# EasyEDA schematic EasyEDA.json
TITLE: Talaria MX5 Killswitch; REV: 1.0; Date: 2026-06-07; Sheet: 1/1; Company: -
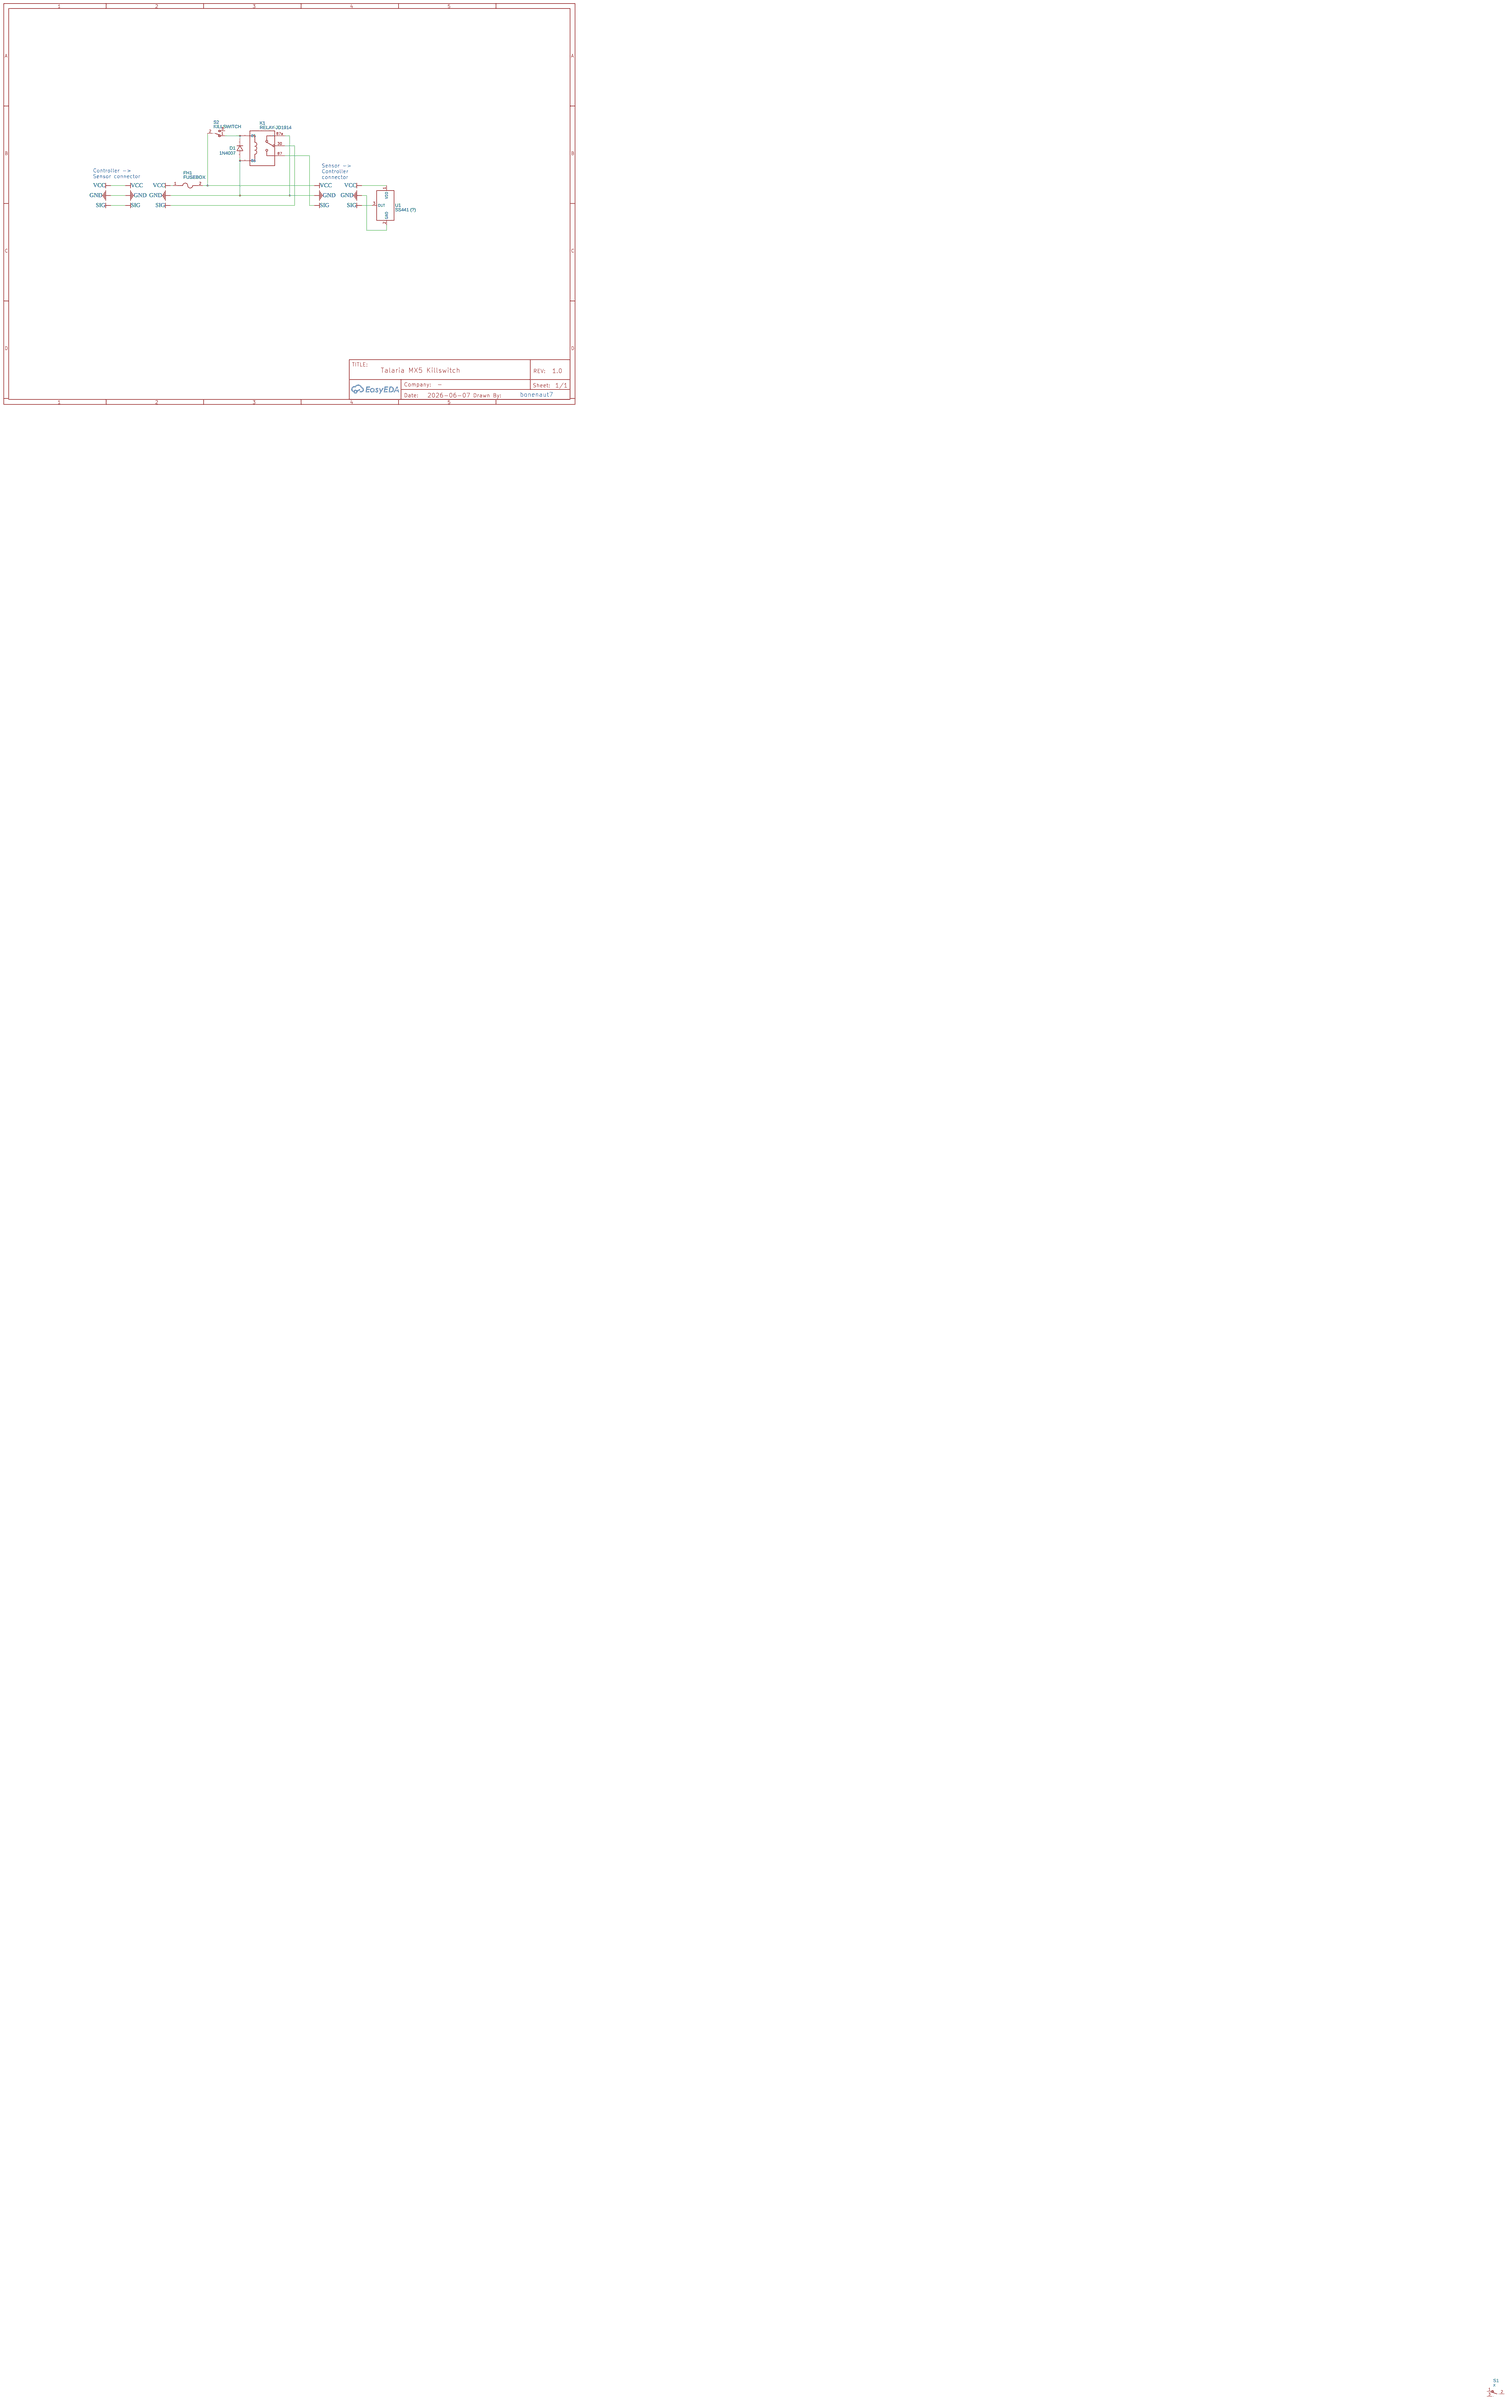
[diagram p0: schematic sheet]

## Parts
D1  1N4007  [SOD-123_L2.8-W1.8-LS3.7-RD]
FH1  FUSEBOX  [FUSE-SMD_L22.7-W10.8]
K1  RELAY-JD1914  [JD1914_FP]
S1  x  [SWITCH-ESWITCH-SLIDE-TH-EG1218]
S2  KILLSWITCH  [SWITCH-ESWITCH-SLIDE-TH-EG1218]
U1  SS441 (?)  [TO-92-3_L4.1-W1.6-P1.27-L]

## Library data of the parts
D1 = 1N4007W: Supplier: LCSC; Supplier Part: C328592; Manufacturer: BLUE ROCKET; Contributor: LCEDA_Lib
FH1 = 0031.8225: Supplier: LCSC; Supplier Part: C5136957; Manufacturer: SCHURTER; JLCPCB Part Class: Extended Part; Contributor: lcsc
K1 = RELAY-JD1914: Manufacturer: SONGLE; Manufacturer Part: SLA-12VDC-SL-C; Contributor: amod; Supplier Part: C125736
S1 S2 = SWITCH-SLIDE-SPDT-200MA-30V: Contributor: wickj4395
U1 = US5881KUA-AAA-000-SP: Supplier: LCSC; Supplier Part: C17633237; Manufacturer: Melexis(比利时迈来芯); Contributor: lcsc; JLCPCB Part Class: Extended Part

## Nets
GND: D1.2 K1.86 K1.87a U1.2(GND)
VCC: FH1.1 FH1.2 S2.2 U1.1(VDD)
SIG: K1.30 K1.87 U1.3(OUT)
Net-(D1-1): D1.1 K1.85 S2.1

Not connected (* = marked no-connect by the designer): S1 1 2 3; S2 3

## Notes on the sheet
- Sensor ->
  Controller
  connector
- Controller ->
  Sensor connector
- bonenaut7
